# Altium schematic sheet PWM_QSPI_SPI_ADC_UART_GPIO_I2C.SchDoc: Dahlia Carrier Board
size A3; Organization: Toradex AG; Address1: Ebenaustrasse 10; Address2: Horw; Address3: 6048; Address4: Switzerland; DocumentNumber: 17; Revision: V1.1; SheetNumber: 17; SheetTotal: 21; PageSetup: Record=PageOptions|CenterHorizontal=True|CenterVertical=True|PrintScale=0.71|XCorrection=1.00|YCorrection=1.00|PrintKind=1|BorderSize=5000000|LeftOffset=0|BottomOffset=0|Orientation=2|PaperLength=1000|PaperWidth=1000|Scale=100|PaperSource=15|PrintQuality=600|MediaType=1|DitherType=10|PaperKind=A4|PrintScaleMode=1
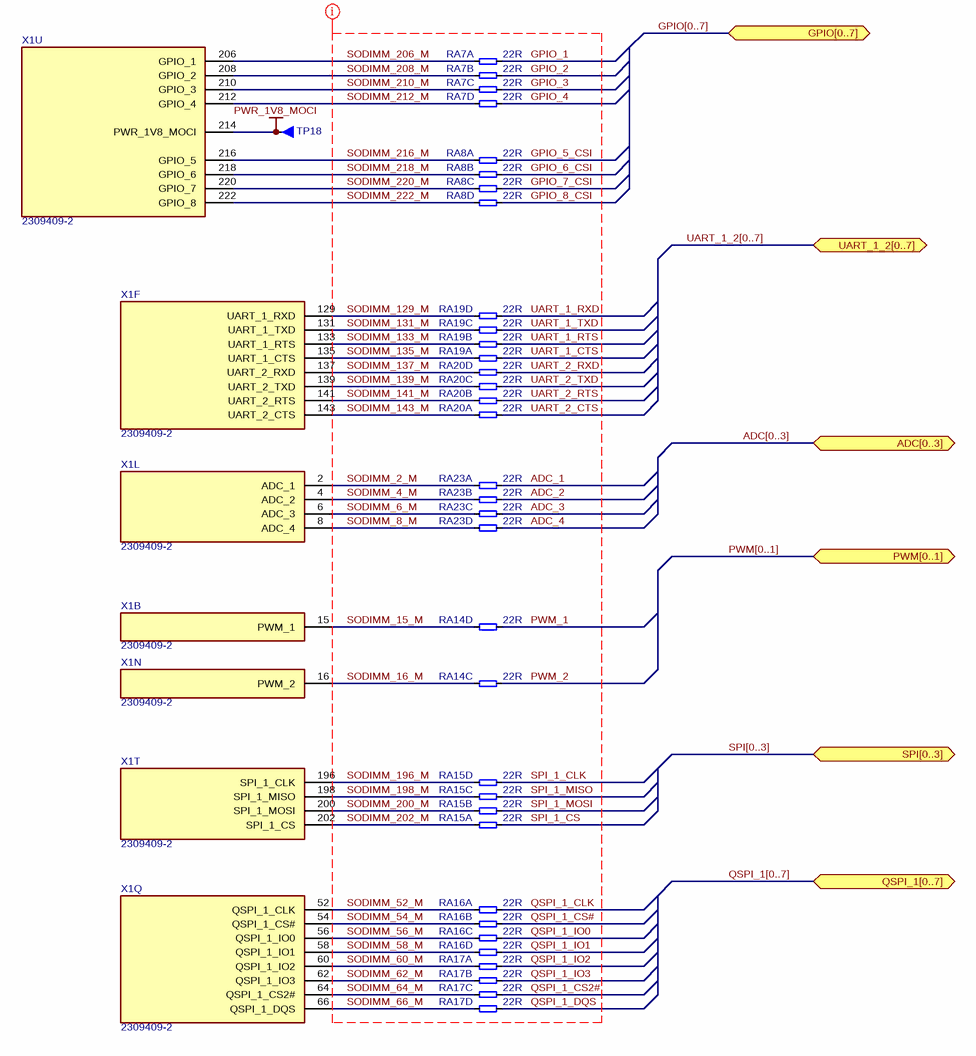
[diagram p0: PWM_QSPI_SPI_ADC_UART_GPIO_I2C.SchDoc]

## Parts
RA7  22R  [T_Resistor_Array_X4]  (parts A,B,C,D of 4)
RA8  22R  [T_Resistor_Array_X4]  (parts A,B,C,D of 4)
RA14  22R  [T_Resistor_Array_X4]  (parts C,D of 4)
RA15  22R  [T_Resistor_Array_X4]  (parts A,B,C,D of 4)
RA16  22R  [T_Resistor_Array_X4]  (parts A,B,C,D of 4)
RA17  22R  [T_Resistor_Array_X4]  (parts A,B,C,D of 4)
RA19  22R  [T_Resistor_Array_X4]  (parts A,B,C,D of 4)
RA20  22R  [T_Resistor_Array_X4]  (parts A,B,C,D of 4)
RA23  22R  [T_Resistor_Array_X4]  (parts A,B,C,D of 4)
TP18  Testpin-THT  [T_TP-THT]  (value not drawn)  (no BOM)
X1  2309409-2  [CON-TE-2309409-2-SOLDERABLE-STANDOFFS]  (parts B,F,L,N,Q,T,U of 23)

## Ports
ADC[0..3] (bidir), GPIO[0..7] (bidir), PWM[0..1] (bidir), QSPI_1[0..7] (bidir), SPI[0..3] (bidir), UART_1_2[0..7] (bidir)

## Nets
PWR_1V8_MOCI: TP18.1 X1.214(PWR_1V8_MOCI)
ADC_1: RA23.5
ADC_2: RA23.6
ADC_3: RA23.7
ADC_4: RA23.8
GPIO_1: RA7.5
GPIO_2: RA7.6
GPIO_3: RA7.7
GPIO_4: RA7.8
GPIO_5_CSI: RA8.5
GPIO_6_CSI: RA8.6
GPIO_7_CSI: RA8.7
GPIO_8_CSI: RA8.8
PWM_1: RA14.8
PWM_2: RA14.7
QSPI_1_CLK: RA16.5
QSPI_1_CS2#: RA17.7
QSPI_1_CS#: RA16.6
QSPI_1_DQS: RA17.8
QSPI_1_IO0: RA16.7
QSPI_1_IO1: RA16.8
QSPI_1_IO2: RA17.5
QSPI_1_IO3: RA17.6
SODIMM_2_M: RA23.1 X1.2(ADC_1)
SODIMM_4_M: RA23.2 X1.4(ADC_2)
SODIMM_6_M: RA23.3 X1.6(ADC_3)
SODIMM_8_M: RA23.4 X1.8(ADC_4)
SODIMM_15_M: RA14.4 X1.15(PWM_1)
SODIMM_16_M: RA14.3 X1.16(PWM_2)
SODIMM_52_M: RA16.1 X1.52(QSPI_1_CLK)
SODIMM_54_M: RA16.2 X1.54(QSPI_1_CS#)
SODIMM_56_M: RA16.3 X1.56(QSPI_1_IO0)
SODIMM_58_M: RA16.4 X1.58(QSPI_1_IO1)
SODIMM_60_M: RA17.1 X1.60(QSPI_1_IO2)
SODIMM_62_M: RA17.2 X1.62(QSPI_1_IO3)
SODIMM_64_M: RA17.3 X1.64(QSPI_1_CS2#)
SODIMM_66_M: RA17.4 X1.66(QSPI_1_DQS)
SODIMM_129_M: RA19.4 X1.129(UART_1_RXD)
SODIMM_131_M: RA19.3 X1.131(UART_1_TXD)
SODIMM_133_M: RA19.2 X1.133(UART_1_RTS)
SODIMM_135_M: RA19.1 X1.135(UART_1_CTS)
SODIMM_137_M: RA20.4 X1.137(UART_2_RXD)
SODIMM_139_M: RA20.3 X1.139(UART_2_TXD)
SODIMM_141_M: RA20.2 X1.141(UART_2_RTS)
SODIMM_143_M: RA20.1 X1.143(UART_2_CTS)
SODIMM_196_M: RA15.4 X1.196(SPI_1_CLK)
SODIMM_198_M: RA15.3 X1.198(SPI_1_MISO)
SODIMM_200_M: RA15.2 X1.200(SPI_1_MOSI)
SODIMM_202_M: RA15.1 X1.202(SPI_1_CS)
SODIMM_206_M: RA7.1 X1.206(GPIO_1)
SODIMM_208_M: RA7.2 X1.208(GPIO_2)
SODIMM_210_M: RA7.3 X1.210(GPIO_3)
SODIMM_212_M: RA7.4 X1.212(GPIO_4)
SODIMM_216_M: RA8.1 X1.216(GPIO_5)
SODIMM_218_M: RA8.2 X1.218(GPIO_6)
SODIMM_220_M: RA8.3 X1.220(GPIO_7)
SODIMM_222_M: RA8.4 X1.222(GPIO_8)
SPI_1_CLK: RA15.8
SPI_1_CS: RA15.5
SPI_1_MISO: RA15.7
SPI_1_MOSI: RA15.6
UART_1_CTS: RA19.5
UART_1_RTS: RA19.6
UART_1_RXD: RA19.8
UART_1_TXD: RA19.7
UART_2_CTS: RA20.5
UART_2_RTS: RA20.6
UART_2_RXD: RA20.8
UART_2_TXD: RA20.7

## Buses and harness runs
bus ADC[0..3] = port ADC[0..3]
bus GPIO[0..7] = port GPIO[0..7]
bus PWM[0..1] = port PWM[0..1]
bus QSPI_1[0..7] = port QSPI_1[0..7]
bus SPI[0..3] = port SPI[0..3]
bus UART_1_2[0..7] = port UART_1_2[0..7]

## Layout directives
net class 50Ohm: ADC_1, ADC_2, ADC_3, ADC_4, GPIO_1, GPIO_2, GPIO_3, GPIO_4, GPIO_5_CSI, GPIO_6_CSI, GPIO_7_CSI, GPIO_8_CSI, PWM_1, PWM_2, QSPI_1_CLK, QSPI_1_CS2#, QSPI_1_CS#, QSPI_1_DQS, QSPI_1_IO0, QSPI_1_IO1, QSPI_1_IO2, QSPI_1_IO3, SODIMM_2_M, SODIMM_4_M, SODIMM_6_M, SODIMM_8_M, SODIMM_15_M, SODIMM_16_M, SODIMM_52_M, SODIMM_54_M, SODIMM_56_M, SODIMM_58_M, SODIMM_60_M, SODIMM_62_M, SODIMM_64_M, SODIMM_66_M, SODIMM_129_M, SODIMM_131_M, SODIMM_133_M, SODIMM_135_M, SODIMM_137_M, SODIMM_139_M, SODIMM_141_M, SODIMM_143_M, SODIMM_196_M, SODIMM_198_M, SODIMM_200_M, SODIMM_202_M, SODIMM_206_M, SODIMM_208_M, SODIMM_210_M, SODIMM_212_M, SODIMM_216_M, SODIMM_218_M, SODIMM_220_M, SODIMM_222_M, SPI_1_CLK, SPI_1_CS, SPI_1_MISO, SPI_1_MOSI, UART_1_CTS, UART_1_RTS, UART_1_RXD, UART_1_TXD, UART_2_CTS, UART_2_RTS, UART_2_RXD, UART_2_TXD

## Notes on the sheet
- Title
- Size:
- Date:
- A3
- Number:
- Time:
- Revision:
- Sheet
- of
- File:

## Library data of the parts
RA7 RA8 RA14-RA17 RA19 RA20 RA23 = RA-22R-63mW-5%-1206-div: Resistor Array 22 R 63mW 5% 1206; Tolerance: 5%; Power Dissipation: 63mW; Value: 22R
TP18 = Testpin-THT: Testpin THT
X1 = CON-TE-2309409-2: DDR4 SODIMM Socket, 260 pins, 5.2mm(H), 0.5mm Pitch; Manufacturer Name: TE; Temperature Range: -40C to +125C; Package: DDR4-SODIMM-260; Manufacturer Part No.: 2309409-2